# Altium project CCZynq.PrjPCB (part 4 of 4)

## Sheet PSCLK.SchDoc
size 431 x 279 mm
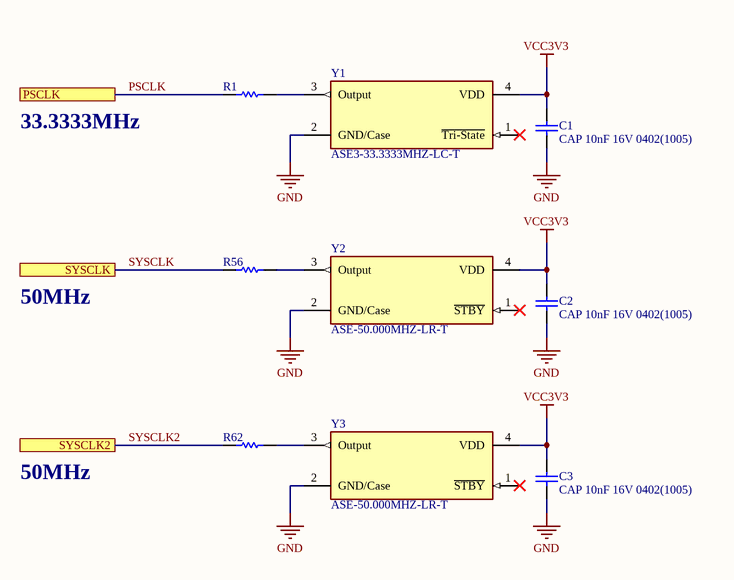
[diagram p9: PSCLK.SchDoc]

### Parts
C1  CAP 10nF 16V 0402(1005)  [CAPC0402(1005)60_M]
C2  CAP 10nF 16V 0402(1005)  [CAPC0402(1005)60_M]
C3  CAP 10nF 16V 0402(1005)  [CAPC0402(1005)60_M]
R1  ERJ2RKF33R0X  [RESC1005X40X25LL05T05]  (value not drawn)
R56  ERJ2RKF33R0X  [RESC1005X40X25LL05T05]  (value not drawn)
R62  ERJ2RKF33R0X  [RESC1005X40X25LL05T05]  (value not drawn)
Y1  ASE3-33.3333MHZ-LC-T  [FP-ASE3-MFG]
Y2  ASE-50.000MHZ-LR-T  [FP-ASE-MFG]
Y3  ASE-50.000MHZ-LR-T  [FP-ASE-MFG]

### Ports
PSCLK, SYSCLK, SYSCLK2

### Nets
GND: C1.1 C2.1 C3.1 Y1.2(GND/Case) Y2.2(GND/Case) Y3.2(GND/Case)
VCC3V3: C1.2 C2.2 C3.2 Y1.4(VDD) Y2.4(VDD) Y3.4(VDD)
PSCLK: R1.1 ; port PSCLK
SYSCLK: R56.1 ; port SYSCLK
SYSCLK2: R62.1 ; port SYSCLK2
NetR1_2: R1.2 Y1.3(Output)
NetR56_2: R56.2 Y2.3(Output)
NetR62_2: R62.2 Y3.3(Output)

Not connected (* = marked no-connect by the designer): Y1 1(~{Tri-State})*; Y2 1(~{STBY})*; Y3 1(~{STBY})*

### Notes on the sheet
- 33.3333MHz
- 50MHz
- DWG. NO.
- REV.
- SHT.
- THIS DOCUMENT AND THE DATA DISCLOSED HEREIN OR HEREWITH IS THE PROPERTY OF ALTIUM LIMITED AND MAY BE FREELY DISTRIBUTED IN WHOLE. NO RIGHTS ARE RESERVED OR EXPRESS OR IMPLIED WARANTEE GIVEN.
- REVISION
- DESCRIPTION
- DATE
- APPROVED
- ENG:
- APPROVALS
- PROJECT
- DSN:
- CHK:
- REFERENCE DOCUMENTS
- PROJECT REVISION:
- TITLE
- DOCUMENT REVISION:
- DESIGN ITEM:
- BOM:
- FAB DWG:
- PCB DWG:
- ASSY DWG:
- SCALE:
- SIZE
- B
- CAGE CODE
- FILE NAME
- DWG NO.
- SHEET
- OF
- REV

### Library data of the parts
C1-C3 = CMP-1034-01878-1: CAP 10nF 16V -20% to +80% 0402 (1005 Metric) Thickness 0.6mm SMD; Case-Metric: 1005; Case-EIA: 0402; Rated Voltage: 16 V; Max Thickness: 0.6 mm; Tolerance: -20% to +80%; Value: 10nF; Technology: SMT
R1 R56 R62 = CMP-2002-01146-1: Manufacturer: Panasonic; Part Number: ERJ2RKF33R0X
Y1 = CMP-27762-006902-1: XTAL Oscillator 33.3333MHz ±50ppm CMOS 1.8V 4-SMD 3.2mm x 2.5mm; Max Supply Current: 6mA; Max Operating Temperature: 85°C; Mount: Surface Mount; Min Operating Temperature: -40°C; Packaging: Tape and Reel; Case/Package: SMD/SMT; Frequency: 33.3333MHz; Frequency Stability: 50ppm
Y2 Y3 = CMP-27762-004169-1: XTAL Oscillator 50MHz ±25ppm CMOS 3.3V 4-SMD 3.2mm x 2.5mm; Max Supply Voltage: 3.465V; Min Supply Voltage: 3.135V; Max Supply Current: 19mA; Load Capacitance: 15pF; Width: 0.098inch; Min Operating Temperature: -40°C; Number of Pins: 4; Frequency: 50MHz; Case/Package: SMD/SMT; REACH SVHC: No SVHC; Height: 0.047inch; Frequency Stability: 25ppm; Mount: Surface Mount; Package Quantity: 1000; Operating Supply Voltage: 3.3V; Max Operating Temperature: 85°C; Packaging: Tape and Reel; Length: 0.126inch; Series: ASE

## Nets that join several sheets
DDRVTT: ZYNQ_DDR3 (36 pins), Power_DDRTermination (C112.1 C113.1 U15.3 U15.5)
GND: ZYNQ_PS (6 pins), ZYNQ_FLASH (12 pins), ZYNQ_DDR3 (57 pins), ZYNQ_PW (103 pins), Power (30 pins), Power_DDRTermination (13 pins), SDCARD (J1.G1 J1.G2 J1.P6), PSCLK (6 pins)
GNDADC: ZYNQ_PS (C5.1 U1.K10), ZYNQ_PW (C50.2 FB1.2 U1.J10)
VCC1V0: ZYNQ_PW (32 pins), Power (6 pins)
VCC1V5: ZYNQ_DDR3 (40 pins), Power (6 pins), Power_DDRTermination (5 pins)
VCC1V8: ZYNQ_PW (28 pins), Power (6 pins)
VCC3V3: ZYNQ_PS (7 pins), ZYNQ_FLASH (21 pins), ZYNQ_PW (44 pins), Power (7 pins), Power_DDRTermination (C120.2 R43.1 U15.7 U15.10), SDCARD (7 pins), PSCLK (6 pins)
VTTREF: ZYNQ_DDR3 (C28.1 C29.2 U14.H1 U14.M8), Power_DDRTermination (C103.2 C110.2 U15.6)
#RE_0: ZYNQ_PS (U1.D5), ZYNQ_FLASH (IC1.D4 R17.1)
#WE_0: ZYNQ_PS (U1.D6), ZYNQ_FLASH (IC1.C7 R21.1)
ALE_0: ZYNQ_PS (U1.B8), ZYNQ_FLASH (IC1.C4 R22.1)
CLK_0: ZYNQ_PS (U1.D8), ZYNQ_FLASH (IC1.D5 R13.1)
CS_0: ZYNQ_PS (U1.E6), ZYNQ_FLASH (IC1.C6 R19.1 R23.2)
IO0_0: ZYNQ_PS (U1.A6), ZYNQ_FLASH (IC1.H4 R7.1 R14.2)
IO1_0: ZYNQ_PS (U1.A5), ZYNQ_FLASH (IC1.J4 R8.1 R15.2)
IO2_0: ZYNQ_PS (U1.B7), ZYNQ_FLASH (IC1.K4 R11.1 R16.2)
IO3_0: ZYNQ_PS (U1.E8), ZYNQ_FLASH (IC1.K5)
IO4_0: ZYNQ_PS (U1.B5), ZYNQ_FLASH (IC1.K6)
IO5_0: ZYNQ_PS (U1.E9), ZYNQ_FLASH (IC1.J7)
IO6_0: ZYNQ_PS (U1.C6), ZYNQ_FLASH (IC1.K7)
IO7_0: ZYNQ_PS (U1.D9), ZYNQ_FLASH (IC1.J8)
PSCLK: ZYNQ_PS (U1.E7), PSCLK (R1.1)
RY/#BY_0: ZYNQ_PS (U1.C5), ZYNQ_FLASH (IC1.C8 R18.1)
SD_CMD: ZYNQ_BANK (U1.P18), SDCARD (J1.P3 R90.1)
SD_DAT0: ZYNQ_BANK (U1.N17), SDCARD (J1.P7 R89.1)
SD_DAT1: ZYNQ_BANK (U1.M19), SDCARD (J1.P8 R88.1)
SD_DAT2: ZYNQ_BANK (U1.R18), SDCARD (J1.P1 R87.1)
SD_DAT3: ZYNQ_BANK (U1.R17), SDCARD (J1.P2 R86.1)
SD_NCD: ZYNQ_BANK (U1.M20), SDCARD (R48.2 R91.1)
SD_SCK: ZYNQ_BANK (U1.N18), SDCARD (J1.P5)
SYSCLK: ZYNQ_BANK (U1.U19), PSCLK (R56.1)
SYSCLK2: ZYNQ_BANK (U1.K17), PSCLK (R62.1)

## Assembly variants
nf: not fitted R13 R? R? R?